# EAGLE design RTI-Dome (EAGLE 7.7.0)
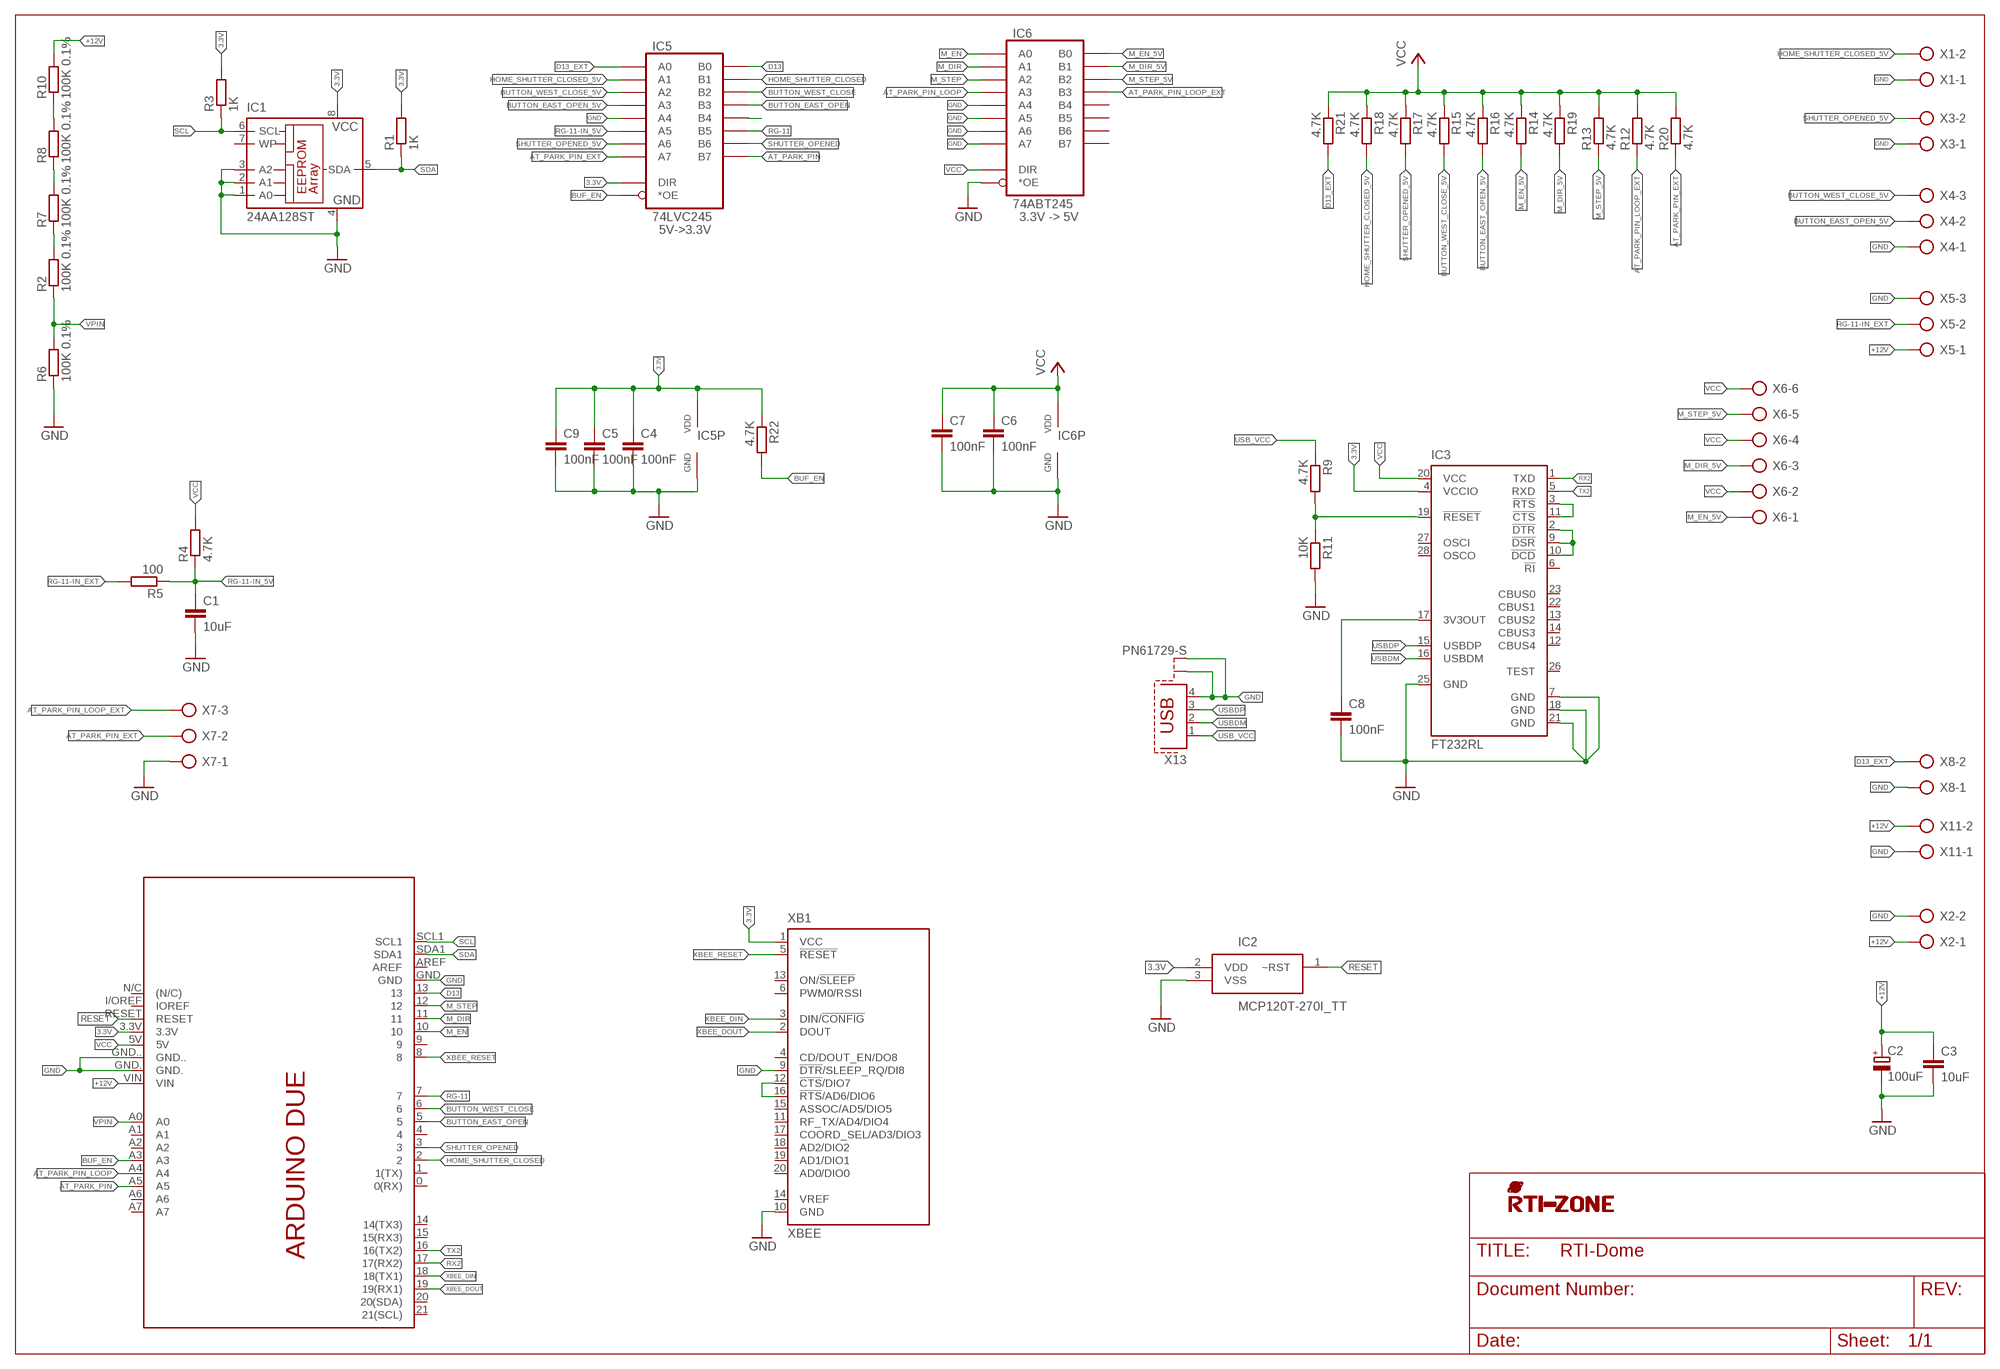
[diagram p0: schematic, sheet 1]

## Parts
C1  10uF  C-EU'0805'  [C0805]
C2  100uF  CPOL-EU  [UD-10X10_NICHICON]
C3  10uF  C-EU'0805'  [C0805]
C4  100nF  C-EU'0805'  [C0805]
C5  100nF  C-EU'0805'  [C0805]
C6  100nF  C-EU'0805'  [C0805]
C7  100nF  C-EU'0805'  [C0805]
C8  100nF  C-EU'0805'  [C0805]
C9  100nF  C-EU'0805'  [C0805]
IC1  24AA128ST  [TSSOP8]
IC2  MCP120T-270I_TT  [SOT95P237X112-3N]
IC3  FT232RL  [SSOP28]
IC5  74LVC245  [TSSOP20]
IC6  74ABT245  [TSSOP20]
PCB1  ARDUINO_DUE_SHIELD_SHORT  [ARDUINO_DUE_SHIELD_SHORT]
R1  1K  R-EU'0805'  [R0805]
R2  100K 0.1%  R-EU'0805'  [R0805]
R3  1K  R-EU'0805'  [R0805]
R4  4.7K  R-EU'0805'  [R0805]
R5  100  R-EU'0805'  [R0805]
R6  100K 0.1%  R-EU'0805'  [R0805]
R7  100K 0.1%  R-EU'0805'  [R0805]
R8  100K 0.1%  R-EU'0805'  [R0805]
R9  4.7K  R-EU'0805'  [R0805]
R10  100K 0.1%  R-EU'0805'  [R0805]
R11  10K  R-EU'0805'  [R0805]
R12  4.7K  R-EU'0805'  [R0805]
R13  4.7K  R-EU'0805'  [R0805]
R14  4.7K  R-EU'0805'  [R0805]
R15  4.7K  R-EU'0805'  [R0805]
R16  4.7K  R-EU'0805'  [R0805]
R17  4.7K  R-EU'0805'  [R0805]
R18  4.7K  R-EU'0805'  [R0805]
R19  4.7K  R-EU'0805'  [R0805]
R20  4.7K  R-EU'0805'  [R0805]
R21  4.7K  R-EU'0805'  [R0805]
R22  4.7K  R-EU'0805'  [R0805]
U$4  RTI-LOGO_BIG  [LOGO_BIG]
X1  AK500/2  [AK500/2]
X2  AK500/2  [AK500/2]
X3  AK500/2  [AK500/2]
X4  AK500/3  [AK500/3]
X5  AK500/3  [AK500/3]
X6  AK500/6  [AK500/6]
X7  AK500/3  [AK500/3]
X8  AK500/2  [AK500/2]
X11  AK500/2  [AK500/2]
X13  PN61729-S  [PN61729-S]
XB1  XBEE  [XBEE]

## Nets
3.3V: C4.1 C5.1 C9.1 IC1.8(VCC) IC2.2(VDD) IC3.4(VCCIO) IC5.P$1(DIR) IC5.P$20(VDD) PCB1.3.3V R1.2 R3.2 R22.1 XB1.1(VCC)
+12V [+12V]: C2.+ C3.1 PCB1.VIN R10.2 X2.1 X5.1 X11.2
AT_PARK_PIN: IC5.P$11(B7) PCB1.A5
AT_PARK_PIN_EXT: IC5.P$9(A7) R20.1 X7.2
AT_PARK_PIN_LOOP: IC6.P$5(A3) PCB1.A4
AT_PARK_PIN_LOOP_EXT: IC6.P$15(B3) R12.1 X7.3
BUF_EN: IC5.P$19(*OE) PCB1.A3 R22.2
BUTTON_EAST_OPEN: IC5.P$15(B3) PCB1.5
BUTTON_EAST_OPEN_5V: IC5.P$5(A3) R16.2 X4.2
BUTTON_WEST_CLOSE: IC5.P$16(B2) PCB1.6
BUTTON_WEST_CLOSE_5V: IC5.P$4(A2) R15.2 X4.3
D13: IC5.P$18(B0) PCB1.13
D13_EXT: IC5.P$2(A0) R21.2 X8.2
DTR_DSR_DCD: IC3.2(!DTR) IC3.9(!DSR) IC3.10(!DCD)
GND [GND]: C1.2 C2.- C3.2 C4.2 C5.2 C6.2 C7.2 C8.2 C9.2 IC1.1(A0) IC1.2(A1) IC1.3(A2) IC1.4(GND) IC2.3(VSS) IC3.7(GND) IC3.18(GND) IC3.21(GND) IC3.25(GND) IC5.P$6(A4) IC5.P$10(GND) IC6.P$6(A4) IC6.P$7(A5) IC6.P$8(A6) IC6.P$9(A7) IC6.P$10(GND) IC6.P$19(*OE) PCB1.GND PCB1.GND. PCB1.GND.. R6.1 R11.2 X1.1 X2.2 X3.1 X4.1 X5.3 X7.1 X8.1 X11.1 X13.4 X13.S1 X13.S2 XB1.9(!DTR!/SLEEP_RQ/DI8) XB1.10(GND)
HOME_SHUTTER_CLOSED: IC5.P$17(B1) PCB1.2
HOME_SHUTTER_CLOSED_5V: IC5.P$3(A1) R18.2 X1.2
M_DIR: IC6.P$3(A1) PCB1.11
M_DIR_5V: IC6.P$17(B1) R19.2 X6.3
M_EN: IC6.P$2(A0) PCB1.10
M_EN_5V: IC6.P$18(B0) R14.2 X6.1
M_STEP: IC6.P$4(A2) PCB1.12
M_STEP_5V: IC6.P$16(B2) R13.1 X6.5
N$1: IC3.19(!RESET) R9.2 R11.1
N$2: R7.2 R8.1
N$3: R8.2 R10.1
N$4: IC5.P$14(B4)
N$5: R2.2 R7.1
N$6: C8.1 IC3.17(3V3OUT)
N$9: XB1.12(!CTS!/DIO7) XB1.16(!RTS!/AD6/DIO6)
RESET: IC2.1(~RST) PCB1.RESET
RG-11: IC5.P$13(B5) PCB1.7
RG-11-IN_5V: C1.1 IC5.P$7(A5) R4.1 R5.1
RG-11-IN_EXT: R5.2 X5.2
RTS_CTS: IC3.3(!RTS) IC3.11(!CTS)
RX2: IC3.1(TXD) PCB1.17(17(RX2))
SCL: IC1.6(SCL) PCB1.SCL1 R3.1
SDA: IC1.5(SDA) PCB1.SDA1 R1.1
SHUTTER_OPENED: IC5.P$12(B6) PCB1.3
SHUTTER_OPENED_5V: IC5.P$8(A6) R17.2 X3.2
TX2: IC3.5(RXD) PCB1.16(16(TX2))
USB_VCC: R9.1 X13.1
USBDM: IC3.16(USBDM) X13.2
USBDP: IC3.15(USBDP) X13.3
VCC: C6.1 C7.1 IC3.20(VCC) IC6.P$1(DIR) IC6.P$20(VDD) PCB1.5V R4.2 R12.2 R13.2 R14.1 R15.1 R16.1 R17.1 R18.1 R19.1 R20.2 R21.1 X6.2 X6.4 X6.6
VPIN: PCB1.A0 R2.1 R6.2
XBEE_DIN: PCB1.18(18(TX1)) XB1.3(DIN/!CONFIG)
XBEE_DOUT: PCB1.19(19(RX1)) XB1.2(DOUT)
XBEE_RESET: PCB1.8 XB1.5(!RESET)
Unconnected: IC1.7(WP) IC3.6(!RI) IC3.12(CBUS4) IC3.13(CBUS2) IC3.14(CBUS3) IC3.22(CBUS1) IC3.23(CBUS0) IC3.26(TEST) IC3.27(OSCI) IC3.28(OSCO) IC6.P$11(B7) IC6.P$12(B6) IC6.P$13(B5) IC6.P$14(B4) PCB1.0(0(RX)) PCB1.1(1(TX)) PCB1.4 PCB1.9 PCB1.14(14(TX3)) PCB1.15(15(RX3)) PCB1.20(20(SDA)) PCB1.21(21(SCL)) PCB1.A1 PCB1.A2 PCB1.A6 PCB1.A7 PCB1.AREF PCB1.I/OREF(IOREF) PCB1.N/C((N/C)) XB1.4(CD/DOUT_EN/DO8) XB1.6(PWM0/RSSI) XB1.11(RF_TX/AD4/DIO4) XB1.13(ON/!SLEEP) XB1.14(VREF) XB1.15(ASSOC/AD5/DIO5) XB1.17(COORD_SEL/AD3/DIO3) XB1.18(AD2/DIO2) XB1.19(AD1/DIO1) XB1.20(AD0/DIO0)

## Notes on the sheet
- 3.3V -> 5V
- 5V->3.3V

## Library data of the parts
C1 C3-C9 = rti:C-EU
C2 = rti:CPOL-EU
IC1 = microchip:24*: Serial EEPROM I2C; MF: MICROCHIP; MPN: 24AA128-I/ST; OC_FARNELL: unknown; OC_NEWARK: 92C6843
IC2 = MCP120T-270I_TT:MCP120T-270I_TT: Microcontroller Supervisory Circuit Source: Datasheet; DESCRIPTION: Microcontroller Supervisory Circuit; HEIGHT: mm; MANUFACTURER_NAME: Microchip; MANUFACTURER_PART_NUMBER: MCP120T-270I/TT; MOUSER_PART_NUMBER: 579-MCP120T-270I/TT; MOUSER_PRICE-STOCK: https://www.mouser.co.uk/ProductDetail/Microchip-Technology/MCP120T-270I-TT?qs=JaP0%252BruNJH91Pwyk6aJdSA%3D%3D
IC3 = ftdichip:FT232R: Source: http://www.ftdichip.com/Documents/DataSheets/DS_FT232R_v104.pdf; MPN: FT232RL; OC_FARNELL: 1146032; OC_NEWARK: 91K9918
IC5 IC6 = rti:74*245
PCB1 = arduino_shield:ARDUINO_DUE_SHIELD_SHORT: Device for representing an Arduino Due board with a footprint in an EAGLE design. Created by Dave Young for Element14. More EAGLE documentation at: http://www.element14.com/community/community/knode/cadsoft_eagle
R1-R22 = rti:R-EU
U$4 = rti:RTI-LOGO
X1-X3 X8 X11 = con-ptr500:AK500/2: CONNECTOR; OC_FARNELL: unknown; OC_NEWARK: unknown
X4 X5 X7 = con-ptr500:AK500/3: CONNECTOR; OC_FARNELL: unknown; OC_NEWARK: unknown
X6 = con-ptr500:AK500/6: CONNECTOR; OC_FARNELL: unknown; OC_NEWARK: unknown
X13 = con-berg:PN61729-S: BERG USB connector; OC_FARNELL: unknown; OC_NEWARK: unknown
XB1 = maxstream:XBEE: XBee (TM) /XBee-PRO(TM) OEM RF Modules Source: MaxStream, Inc. xbee_productmanual.pdf; MPN: XBP24-Z7UIT-004; OC_FARNELL: 1751799; OC_NEWARK: 34R5507

## Net classes
0 default: width 0.254 mm, drill 0.3 mm, clearance 0.203 mm
1 +12V: width 0.254 mm, drill 0.3 mm, clearance 0.203 mm
2 GND: width 0.254 mm, drill 0.3 mm, clearance 0.203 mm

## Board
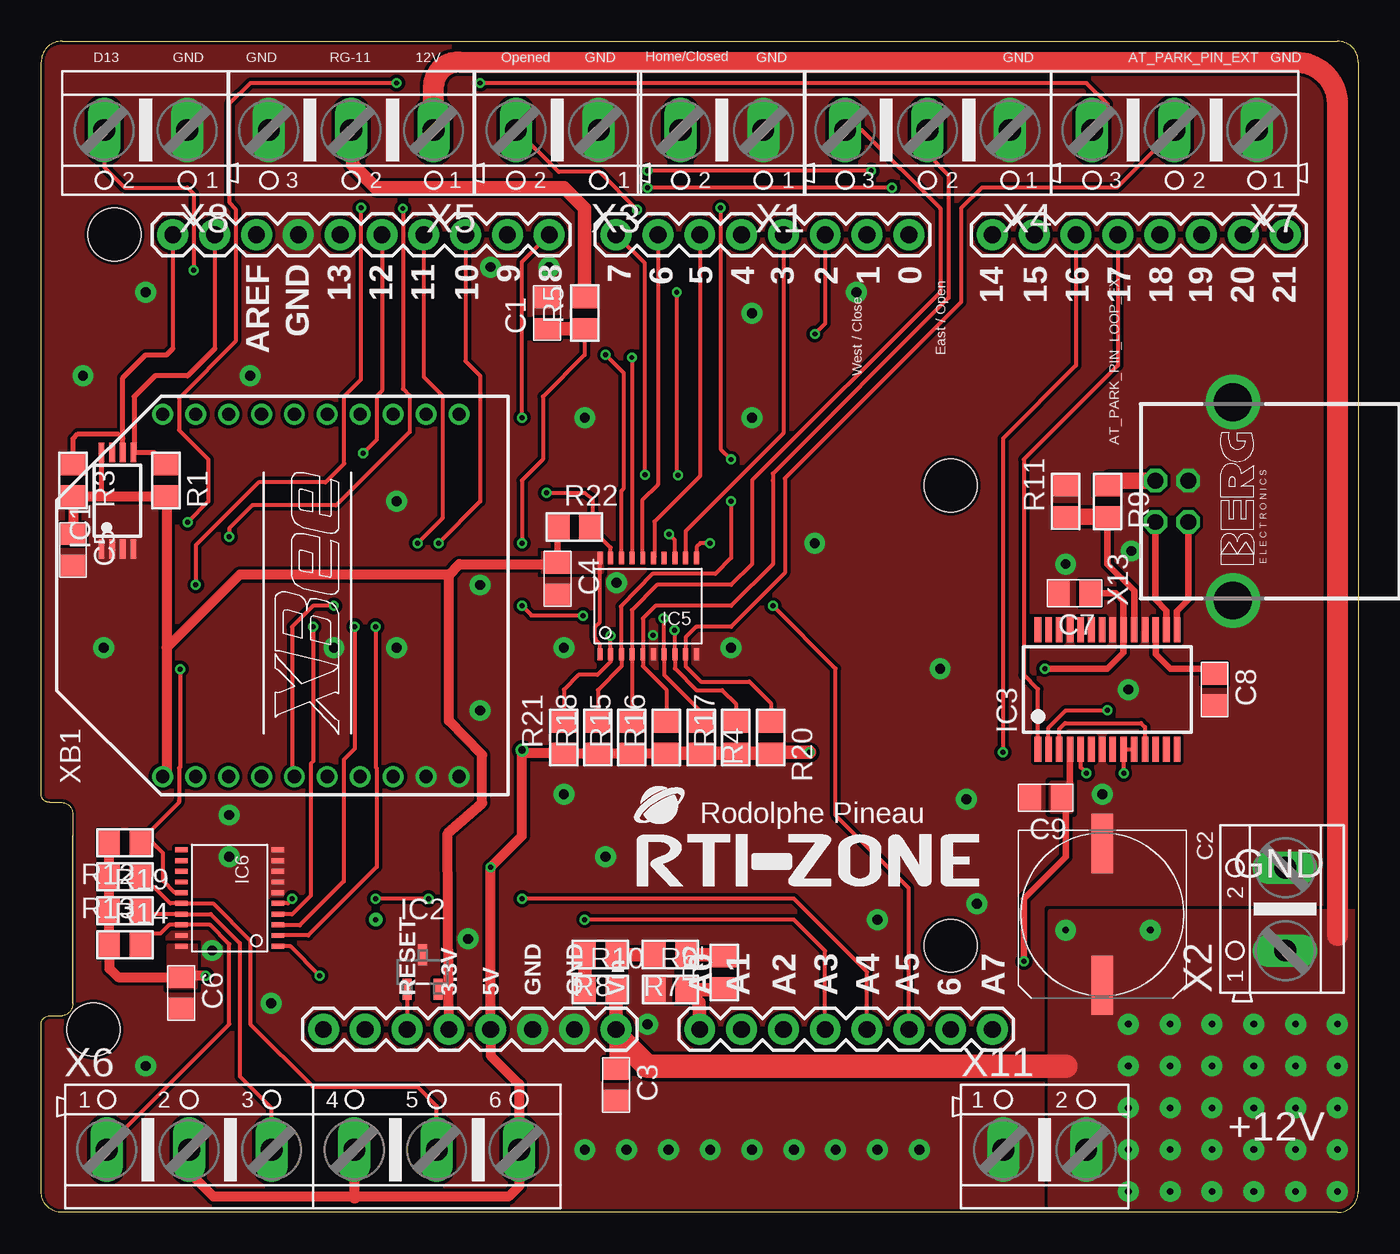
[diagram p1: board, top side]
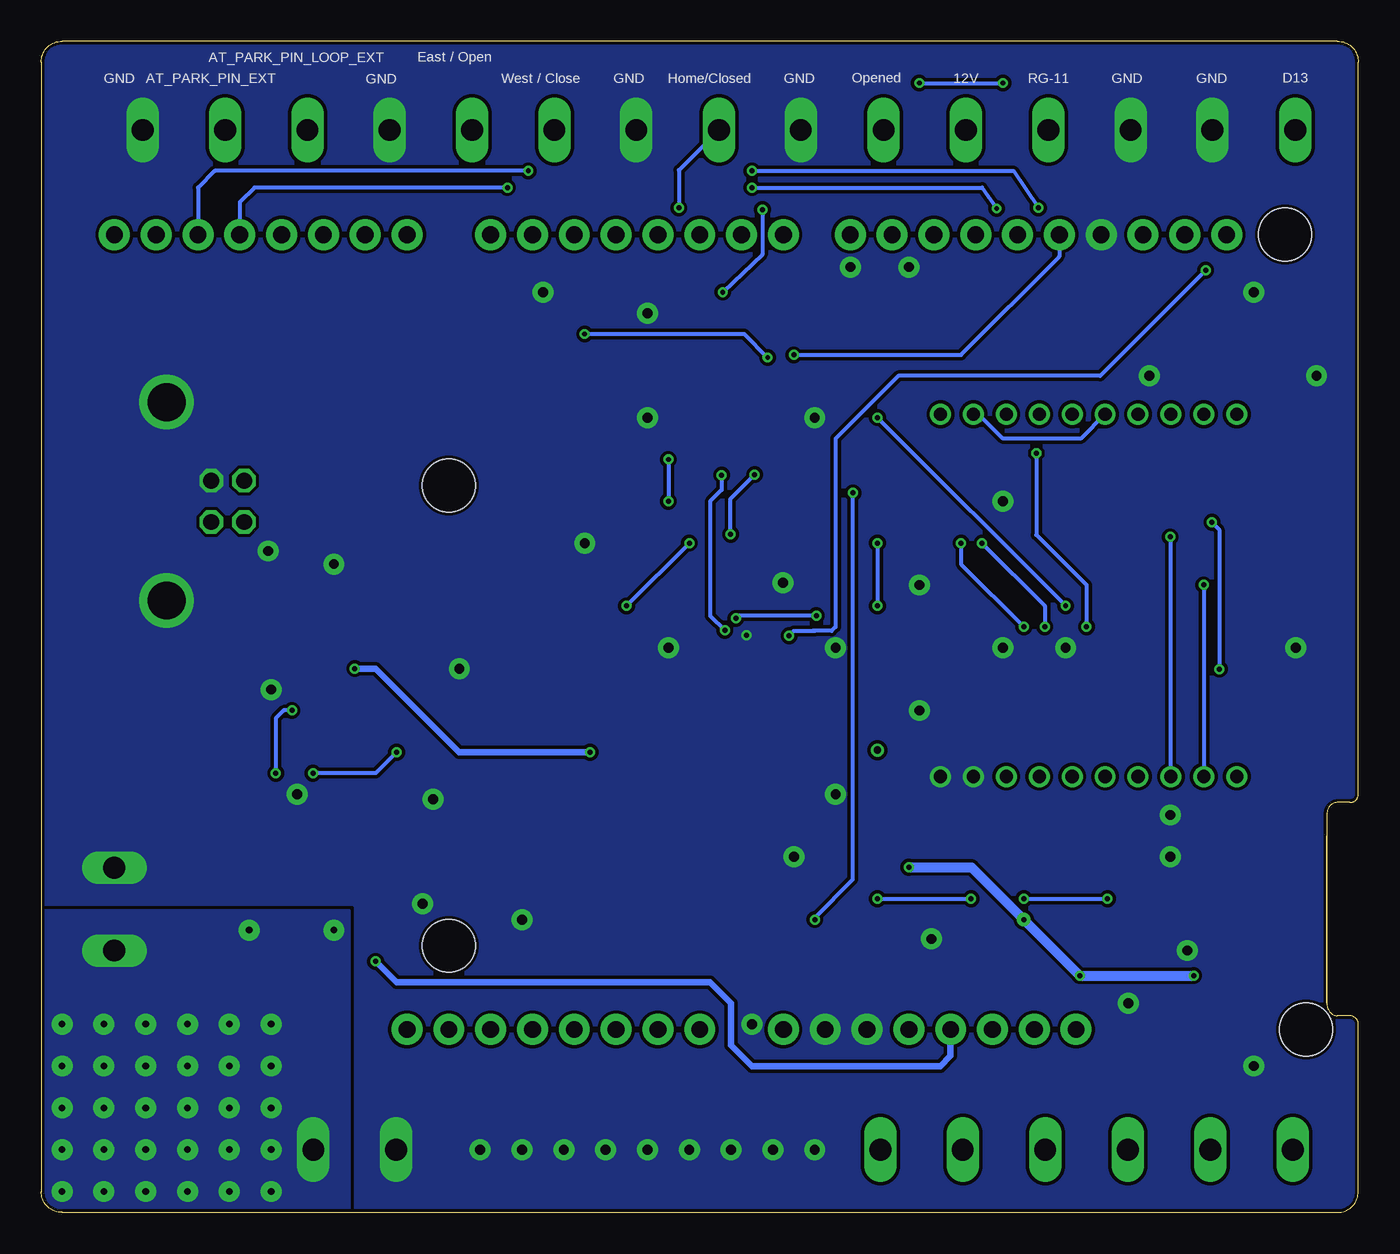
[diagram p2: board, bottom side, seen from below]

Size 80.01 x 71.12 mm. Coordinates in mm from the lower left corner, seen from the top.
Outline: 1.91,22.86 1.91,12.7
Outline: 1.91,12.7 1.91,22.86
Outline: 1.91,12.7 arc-90 1.27,11.94 0.51,11.94 arc90 0,11.43 0,1.27 arc90 1.27,0 78.74,0 arc90 80.01,1.27 80.01,69.85 arc90 78.74,71.12 1.27,71.12 arc90 0,69.85 0,25.4 arc90 0.51,24.89 1.27,24.89 arc-90 1.91,24.26 1.91,22.86
Copper layers (1*16): Top 0.35mm / dielectric 1.6mm / Bottom 0.35mm
Design rules "jlcpcb2layer": minimum track width 5mil, minimum drill 0.2mm, track to track 5mil, track to pad 5mil, pad to pad 5mil, via to via 5mil, smd to smd 5mil, copper to edge 8mil, drill to drill 0.5mm, minimum pad ring 6mil, minimum via ring 6mil, stop-mask expansion 0.05mm, vias tented up to drill 130mil, thermal gap 8mil

### Footprints (pad centres in the part's own frame; a part is rotated, then mirrored left to right if it is on the bottom)
C0805 = smd 1.3 x 1.5: 1 -0.95,0; 2 0.95,0
UD-10X10_NICHICON = smd 3.6 x 1.3: + 4.3,0; - -4.3,0
TSSOP8 = smd 0.35 x 1.2: 1 -0.975,-2.925; 2 -0.325,-2.925; 3 0.325,-2.925; 4 0.975,-2.925; 5 0.975,2.925; 6 0.325,2.925; 7 -0.325,2.925; 8 -0.975,2.925
SOT95P237X112-3N = smd 0.559 x 1.27: 1 -0.94,-1.041; 2 0.94,-1.041; 3 0,1.041
SSOP28 = smd 0.4 x 1.5: 1 -4.225,-3.625; 2 -3.575,-3.625; 3 -2.925,-3.625; 4 -2.275,-3.625; 5 -1.625,-3.625; 6 -0.975,-3.625; 7 -0.325,-3.625; 8 0.325,-3.625; 9 0.975,-3.625; 10 1.625,-3.625; 11 2.275,-3.625; 12 2.925,-3.625; 13 3.575,-3.625; 14 4.225,-3.625; 15 4.225,3.625; 16 3.575,3.625; 17 2.925,3.625; 18 2.275,3.625; 19 1.625,3.625; 20 0.975,3.625; 21 0.325,3.625; 22 -0.325,3.625; 23 -0.975,3.625; 24 -1.625,3.625; 25 -2.275,3.625; 26 -2.925,3.625; 27 -3.575,3.625; 28 -4.225,3.625
TSSOP20 = smd 0.75 x 0.3: P$1 -2.94,2.885; P$2 -2.94,2.235; P$3 -2.94,1.585; P$4 -2.94,0.935; P$5 -2.94,0.285; P$6 -2.94,-0.365; P$7 -2.94,-1.015; P$8 -2.94,-1.665; P$9 -2.94,-2.315; P$10 -2.94,-2.965; P$11 2.91,-2.965; P$12 2.91,-2.315; P$13 2.91,-1.665; P$14 2.91,-1.015; P$15 2.91,-0.365; P$16 2.91,0.285; P$17 2.91,0.935; P$18 2.91,1.585; P$19 2.91,2.235; P$20 2.91,2.885
ARDUINO_DUE_SHIELD_SHORT = drill 1.016 pad 1.88: 0 12.7,26.67; 1 10.16,26.67; 2 7.62,26.67; 3 5.08,26.67; 3.3V -15.24,-21.59; 4 2.54,26.67; 5 0,26.67; 5V -12.7,-21.59; 6 -2.54,26.67; 7 -5.08,26.67; 8 -9.144,26.67; 9 -11.684,26.67; 10 -14.224,26.67; 11 -16.764,26.67; 12 -19.304,26.67; 13 -21.844,26.67; 14 17.78,26.67; 15 20.32,26.67; 16 22.86,26.67; 17 25.4,26.67; 18 27.94,26.67; 19 30.48,26.67; 20 33.02,26.67; 21 35.56,26.67; A0 0,-21.59; A1 2.54,-21.59; A2 5.08,-21.59; A3 7.62,-21.59; A4 10.16,-21.59; A5 12.7,-21.59; A6 15.24,-21.59; A7 17.78,-21.59; AREF -26.924,26.67; GND -24.384,26.67; GND. -7.62,-21.59; GND.. -10.16,-21.59; I/OREF -20.32,-21.59; N/C -22.86,-21.59; RESET -17.78,-21.59; SCL1 -32.004,26.67; SDA1 -29.464,26.67; VIN -5.08,-21.59 | hole 3.2: -35.56,26.67; -36.83,-21.59; 15.24,11.43; 15.24,-16.51
R0805 = smd 1.3 x 1.5: 1 -0.95,0; 2 0.95,0
AK500/2 = drill 1.321 long: 1 -2.515,0; 2 2.515,0
AK500/3 = drill 1.321 long: 1 -5.004,0; 2 0,0; 3 5.004,0
AK500/6 = drill 1.321 long: 1 -12.522,0; 2 -7.518,0; 3 -2.515,0; 4 2.515,0; 5 7.518,0; 6 12.522,0
PN61729-S = drill 0.95 octagon: 1 1.25,4.71; 2 -1.25,4.71; 3 -1.25,2.71; 4 1.25,2.71 | drill 2.3 pad 2.9: S1 -6.02,0; S2 6.02,0
XBEE = drill 0.8 pad 1.27: 1 -11,9; 2 -11,7; 3 -11,5; 4 -11,3; 5 -11,1; 6 -11,-1; 7 -11,-3; 8 -11,-5; 9 -11,-7; 10 -11,-9; 11 11,-9; 12 11,-7; 13 11,-5; 14 11,-3; 15 11,-1; 16 11,1; 17 11,3; 18 11,5; 19 11,7; 20 11,9

### Placement (x,y rotation side)
C1  30.73,54.61 90 top
C2  64.45,18.1 270 top
C3  34.92,7.75 270 top
C4  31.37,38.48 270 top
C5  1.94,40.23 270 top
C6  8.51,13.34 270 top
C7  62.77,37.59 180 top
C8  71.28,31.75 270 top
C9  61.02,25.18 180 top
IC1  4.64,43.21 0 top
IC2  23.18,14.61 0 top
IC3  64.77,31.75 0 top
IC5  36.83,36.83 90 top
IC6  11.43,19.05 180 top
PCB1  40.01,32.7 0 top
R1  7.59,44.45 270 top
R2  41.5,14.57 90 top
R3  1.94,44.45 270 top
R4  40.1,28.83 270 top
R5  33.02,54.61 90 top
R6  38.23,13.53 0 top
R7  38.23,15.65 180 top
R8  33.97,15.65 180 top
R9  64.77,43.18 270 top
R10  33.97,13.53 0 top
R11  62.23,43.18 90 top
R12  5.08,22.45 180 top
R13  5.08,20.38 180 top
R14  5.08,16.26 0 top
R15  35.88,28.83 90 top
R16  37.97,28.83 90 top
R17  42.2,28.83 90 top
R18  33.81,28.83 90 top
R19  5.08,18.32 0 top
R20  44.32,28.83 270 top
R21  31.75,28.83 90 top
R22  32.38,41.62 0 top
U$4  36.2,19.81 0 top
X1  41.35,65.72 180 top
X2  75.56,18.41 90 top
X3  31.35,65.72 180 top
X4  53.84,65.72 180 top
X5  18.83,65.72 180 top
X6  16.51,3.81 0 top
X7  68.84,65.72 180 top
X8  6.35,65.72 180 top
X11  60.96,3.81 0 top
X13  72.39,43.18 90 top
XB1  16.38,37.47 90 top

### Tracks (layer width: path | path; a pad name or v marks a point on that pad's centre or on a via)
3.3V  (via drill 0.3)
  Top 0.254: IC5.P$1 33.94,34.51 33.69,34.77 33.69,34.86 33.66,34.89 33.66,35.56 33.95,35.85 IC5.P$20 | IC2.2 24.66,13.56 24.75,13.66
  Top 0.305: IC1.8 3.66,43.65 3.81,43.5
  Top 0.406: 31.43,39.49 C4.1 31.37,41.56 R22.1 | v59.69,15.24 59.69,16.51 59.69,19.05 62.23,21.59 62.23,24.92 C9.1 | IC3.4 62.49,25.66 62.23,25.4
  Top 0.61: 24.77,38.73 25.4,39.37 31.31,39.37 | 24.77,38.73 12.06,38.73 7.62,34.29 | 7.62,34.29 7.62,26.7 XB1.1 | PCB1.3.3V 24.75,13.66 24.7,23.02 26.8,24.86 26.8,27.78 24.77,29.84 24.77,38.73 | 7.62,34.29 7.62,43.47 arc90 R1.2 3.81,43.5 R3.2 C5.1
  Top 0.813: 31.31,39.37 C4.1
  Bottom 0.406: PCB1.3.3V 24.77,9.53 25.4,8.89 36.83,8.89 38.1,10.16 38.1,12.7 39.37,13.97 58.42,13.97 v59.69,15.24
  pour Top (isolate 0.254, no thermals): 30.48,40.07 34.07,40.07 34.07,38.86 30.48,38.86
  pour Top (no thermals): 61.4,26.04 62.55,26.04 62.55,24.38 61.4,24.38
+12V  (via drill 0.4 pad 1.27)
  Top 0.813: 34.95,11.14 PCB1.VIN | R10.2 PCB1.VIN | C3.1 PCB1.VIN
  Top 1.27: X5.1 23.83,68.38 arc-90 25.4,69.85 76.2,69.85 arc-90 78.74,67.31 78.74,16.83
  Top 1.422: PCB1.VIN 34.92,10.79 36.83,8.89 62.23,8.89
  other vias: 66.04,8.89 68.58,8.89 71.12,8.89 73.66,8.89 76.2,8.89 78.74,8.89 78.74,6.35 76.2,6.35 73.66,6.35 71.12,6.35 68.58,6.35 66.04,6.35 66.04,3.81 68.58,3.81 71.12,3.81 73.66,3.81 76.2,3.81 78.74,3.81 66.04,1.27 68.58,1.27 71.12,1.27 73.66,1.27 76.2,1.27 78.74,1.27 68.58,11.43 71.12,11.43 78.74,11.43 66.04,11.43 62.23,17.14 73.66,11.43 67.37,17.14 76.2,11.43
  pour Top (no thermals): 61.31,18.29 79.88,18.29 79.88,0 61.31,0
  pour Bottom (no thermals): 61.31,18.29 79.88,18.29 79.88,0 61.31,0
AT_PARK_PIN  (via drill 0.3 pad 0.25)
  Top 0.254: PCB1.A5 52.7,19.68 48.26,24.13 48.26,33.02 v44.45,36.83 | v40.64,40.64 40.04,40.64 39.81,40.42 39.81,39.76 IC5.P$11
  Bottom 0.254: v44.45,36.83 v40.64,40.64
AT_PARK_PIN_EXT
  Top 0.254: R20.1 44.32,30.92 43.02,32.23 40.07,32.23 39.15,33.15 IC5.P$9 39.15,34.92 39.78,35.56 41.91,35.56 45.18,38.83 45.18,44.58 55.88,55.28 55.88,60.96 57.15,62.23 65.35,62.23 X7.2
AT_PARK_PIN_LOOP  (via drill 0.3 pad 0.25)
  Top 0.254: PCB1.A4 50.16,14.61 45.72,19.05 v29.21,19.05 | v23.53,19.05 v20.32,19.05 | v15.24,19.05 15.24,19.02 14.99,18.76 IC6.P$5
  Bottom 0.254: v29.21,19.05 v23.53,19.05 | v20.32,19.05 v15.24,19.05
AT_PARK_PIN_LOOP_EXT  (via drill 0.3 pad 0.25)
  Top 0.254: IC6.P$15 8.11,19.41 7.4,20.13 7.4,21.81 6.99,22.23 6.35,22.86 8.38,24.89 8.38,25.02 8.38,26.99 8.45,27.05 v8.45,32.99 | 6.35,22.77 R12.1 | X7.3 64.78,67.3 63.5,68.58 v26.67,68.58 | v21.59,68.58 12.7,68.58 11.43,67.31 11.43,61.34 11.81,60.93 11.81,52.9 8.38,49.44 8.38,47.5 10.16,45.72 10.16,43.18 v8.89,41.91
  Top 0.305: 6.35,22.86 6.35,22.77
  Bottom 0.254: v26.67,68.58 v21.59,68.58 | v8.89,41.91 8.45,41.47 v8.45,32.99
BUF_EN  (via drill 0.3 pad 0.25)
  Top 0.254: IC5.P$19 34.59,40.36 R22.2 33.5,41.78 33.5,43.34 33.02,43.69 v30.7,43.69 | PCB1.A3 47.62,15.88 45.72,17.78 v33.02,17.78
  Bottom 0.254: v33.02,17.78 33.02,17.91 30.7,20.23 v30.7,43.69
BUTTON_EAST_OPEN
  Top 0.254: PCB1.5 40.01,44.7 37.24,41.94 37.24,39.79 IC5.P$15
BUTTON_EAST_OPEN_5V
  Top 0.254: R16.2 37.97,31.75 36.55,33.18 IC5.P$5 36.54,36.07 37.31,36.83 41.91,36.83 44.45,39.37 44.45,44.45 44.45,44.86 55.12,55.53 55.12,62.99 53.84,64.27 X4.2
BUTTON_WEST_CLOSE
  Top 0.254: PCB1.6 37.47,44.2 36.51,43.24 36.51,39.77 IC5.P$16
BUTTON_WEST_CLOSE_5V
  Top 0.254: R15.2 35.9,29.8 IC5.P$4 35.88,33.91 35.88,36.58 37.4,38.1 41.91,38.1 43.18,39.37 43.18,44.45 54.61,55.88 54.61,60.96 49.85,65.72 X4.3
D13  (via drill 0.3 pad 0.25)
  Top 0.254: IC5.P$18 35.24,43.82 35.4,43.97 35.4,50.96 v34.29,52.07
  Bottom 0.254: PCB1.13 18.16,58.04 24.13,52.07 v34.29,52.07
D13_EXT  (via drill 0.3 pad 0.25)
  Top 0.254: R21.2 31.75,31.75 32.64,32.64 33.78,32.64 34.59,33.45 IC5.P$2 34.58,33.91 v34.58,35.02 | v9.27,57.21 9.27,61.85 8.89,62.23 5.08,62.23 3.83,63.48 X8.2
  Bottom 0.254: v9.27,57.21 15.68,50.8 27.94,50.8 31.75,46.99 31.75,35.56 32,35.31 33.02,35.31 | 33.02,35.31 33.15,35.31 | v34.58,35.02 34.29,35.31 33.02,35.31
DTR_DSR_DCD  (via drill 0.3)
  Top 0.254: IC3.2 61.2,29.45 62.23,30.48 v64.77,30.48 | v65.75,26.67 65.75,28.12 | IC3.9 IC3.10
  Top 0.305: 65.75,28.12 IC3.9
  Bottom 0.254: v64.77,30.48 65.28,30.48 65.75,30 v65.75,26.67
GND  (via drill 0.3 pad 0.25, 0.6 pad 1.27)
  other vias: 41.91,34.29 26.67,38.1 43.18,48.26 31.75,25.4 26.67,30.48 33.02,48.26 30.86,57.4 27.3,57.4 21.59,43.18 17.78,34.29 66.23,40.16 12.7,50.8 56.2,25.08 11.43,21.59 62.23,39.37 50.8,17.78 34.29,21.59 54.61,33.02 64.45,25.4 56.83,18.73 43.18,54.61 34.96,38.23 46.99,40.64 49.53,55.88 21.59,34.29 3.81,34.29 31.75,34.29 66.04,31.75 11.43,24.13 13.97,12.7 25.94,16.61 6.35,8.89 10.38,15.91 33.02,3.81 2.54,50.8 6.35,55.88 36.83,11.43 37.18,35.05 35.56,3.81 38.1,3.81 40.64,3.81 43.18,3.81 45.72,3.81 48.26,3.81 50.8,3.81 53.34,3.81
  pour Bottom (rank 2, no thermals): 0,0 0,71.12 80.01,71.12 80.01,0
  pour Top (rank 2, no thermals): 0,0 0,71.12 80.01,71.12 80.01,0
HOME_SHUTTER_CLOSED  (via drill 0.3 pad 0.25)
  Top 0.254: PCB1.2 47.62,53.98 v46.99,53.34 | 35.88,39.76 IC5.P$17 35.88,39.76 | v35.88,51.91 35.88,39.76
  Bottom 0.254: v46.99,53.34 37.31,53.34 v35.88,51.91
HOME_SHUTTER_CLOSED_5V  (via drill 0.3 pad 0.25)
  Top 0.254: R18.2 33.81,31.72 35.24,33.15 IC5.P$3 35.21,33.92 35.21,36.8 37.15,38.77 40.96,38.77 41.91,39.75 v41.91,43.18 | v41.27,60.99 41.27,46.35 v41.91,45.72
  Bottom 0.254: v41.91,45.72 v41.91,43.18 | X1.2 41.27,63.28 v41.27,60.99
M_DIR  (via drill 0.3 pad 0.25)
  Top 0.254: PCB1.11 23.24,50.74 24.38,49.59 24.38,42.16 v22.86,40.64 | v19.05,35.56 19.05,28.16 18.38,27.5 18.38,20.1 15.72,17.43 14.4,17.43 IC6.P$3
  Bottom 0.254: v22.86,40.64 19.05,36.83 v19.05,35.56
M_DIR_5V
  Top 0.254: R19.2 6.24,18.11 IC6.P$17 10.3,18.11 12.06,16.35 12.06,8.26 13.99,6.33 X6.3
M_EN  (via drill 0.3 pad 0.25)
  Top 0.254: PCB1.10 25.78,51.69 26.67,50.8 26.67,43.18 v24.13,40.64 | v20.32,35.56 20.32,27.02 20.38,26.96 20.38,20.99 16.22,16.83 14.38,16.83 IC6.P$2
  Bottom 0.254: v24.13,40.64 24.13,39.37 v20.32,35.56
M_EN_5V
  Top 0.254: R14.2 6.7,16.92 7.24,16.92 7.78,17.46 IC6.P$18 10.26,17.46 11.43,16.29 11.43,11.43 3.99,3.99 X6.1
M_STEP  (via drill 0.3 pad 0.25)
  Top 0.254: PCB1.12 20.7,49.88 20.38,49.56 20.38,46.93 v19.56,46.1 | v16.51,35.56 16.51,27.37 16.38,27.24 16.38,19.24 15.24,18.1 14.39,18.1 IC6.P$4
  Bottom 0.254: v19.56,46.1 19.56,41.15 16.51,38.1 v16.51,35.56
M_STEP_5V
  Top 0.254: R13.1 6.67,19.75 6.86,19.75 7.84,18.77 IC6.P$16 10.45,18.77 12.7,16.51 12.7,11.43 16.51,7.62 22.86,7.62 24.03,6.45 X6.5
N$1
  Top 0.406: IC3.19 66.39,37.74 64.77,39.37 R9.2
  Top 1.016: R11.1 R9.2
N$2
  Top 0.813: R8.1 R7.2
N$3
  Top 0.813: R8.2 R10.1
N$5
  Top 0.813: R7.1 41.37,15.65 R2.2
N$6
  Top 0.406: IC3.17 67.69,33.91 68.58,33.02 70.99,33.02 C8.1
N$9
  Bottom 0.254: XB1.16 16.86,46.99 21.59,46.99 23.07,48.47 XB1.12
RESET
  Top 0.254: IC2.1 22.24,11.12 PCB1.RESET
RG-11  (via drill 0.3 pad 0.25)
  Top 0.254: v36.67,44.8 36.67,57.63 PCB1.7 | IC5.P$13 38.49,40.82 v38.13,41.18
  Bottom 0.254: v38.13,41.18 38.13,43.34 v36.67,44.8
RG-11-IN_5V  (via drill 0.3 pad 0.25)
  Top 0.254: R4.1 40.1,30.39 37.84,32.64 IC5.P$7 37.81,33.92 v37.81,36.07 | R5.1 33.02,52.07 30.48,49.53 30.48,45.72 29.21,44.45 v29.21,40.64 | v29.21,36.83 29.78,36.26 32.89,36.26 v32.92,36.23
  Top 0.813: C1.1 R5.1
  Bottom 0.254: v29.21,40.64 v29.21,36.83 | v32.92,36.23 37.66,36.23 v37.81,36.07
RG-11-IN_EXT
  Top 0.813: R5.2 33.02,60.96 31.75,62.23 20.32,62.23 18.92,63.63 X5.2
RTS_CTS
  Top 0.254: IC3.3 61.84,29.36 62.2,29.72 66.8,29.72 67.06,29.46 67.06,28.14 IC3.11
RX2
  Top 0.254: PCB1.17 65.41,51.44 59.69,45.72 59.69,32.64 60.55,31.78 IC3.1
  Top 0.406: IC3.1
SCL
  Top 0.254: PCB1.SCL1 8,52.45
  Top 0.305: IC1.6 4.96,46.99 | 4.96,46.99 4.96,50.68 6.35,52.07 7.62,52.07 8,52.45 | R3.1 1.94,46.99 2.22,47.28 4.67,47.28 4.96,46.99
SDA
  Top 0.254: PCB1.SDA1 10.54,52.45
  Top 0.305: 10.54,52.45 8.89,50.8 6.92,50.8 5.65,49.53 5.65,46.18 IC1.5 6.85,46.14 R1.1
SHUTTER_OPENED
  Top 0.254: PCB1.3 45.09,47.31 39.15,41.37 IC5.P$12
SHUTTER_OPENED_5V  (via drill 0.3 pad 0.25)
  Top 0.254: R17.2 42.2,30.89 41.37,31.72 39.81,31.72 38.49,33.04 IC5.P$8 38.48,33.9 v38.48,35.34 | v38.61,55.88 38.61,44.83 v38.67,44.77 | v36.2,60.9 33.91,63.18 31.43,63.18 28.89,65.72 X3.2
  Bottom 0.254: v36.2,60.9 36.2,58.17 v38.61,55.88 | v38.67,44.77 38.67,43.88 39.37,43.18 39.37,36.23 v38.48,35.34
TX2  (via drill 0.3)
  Top 0.254: PCB1.16 62.87,51.44 58.42,46.99 v58.42,27.94 | v63.5,26.67 63.15,27.02 IC3.5
  Top 0.406: 63.15,28.13 IC3.5
  Bottom 0.254: v58.42,27.94 59.69,26.67 v63.5,26.67
USB_VCC
  Top 1.016: X13.1 64.94,44.43 R9.1
USBDM
  Top 0.406: X13.2 67.68,37.22 68.36,36.54 68.36,35.39 IC3.16
USBDP
  Top 0.406: X13.3 69.68,37.2 68.99,36.51 IC3.15
VCC  (via drill 0.3, 0.3 pad 0.25, 0.3 pad 0.81, 0.45 pad 0.81)
  Top 0.254: v16.92,14.38 15.14,16.16 IC6.P$1
  Top 0.406: v60.96,33.02 64.77,33.02 65.75,33.99 IC3.20 65.75,37.12 65.28,37.59 C7.1
  Top 0.61: C6.1 | C6.1 4.67,14.29 4.16,14.79 4.16,16.22 R14.1 R19.1 R13.2 | v10,14.38 8.61,14.38 C6.1 | 8.89,3.71 8.89,2.54 10.48,0.95 19.05,0.95 28.38,0.95 29.03,1.6 X6.6 29.03,7.8 27.3,9.53 PCB1.5V v27.3,20.95 29.21,22.86 v29.21,28.07 29.4,27.88 R21.1 R18.1 R15.1 R16.1 | X6.4 19.02,0.98 | R13.2 3.87,20.38 3.81,20.32 | R13.2 R12.2
  Top 0.813: 8.89,3.71 X6.2 | 19.02,0.98 19.05,0.95 | C6.1 | R16.1 R4.2 R17.1 R20.2 44.38,27.94 v46.67,27.94
  Bottom 0.406: v60.96,33.02 59.69,33.02 54.61,27.94 v46.67,27.94
  Bottom 0.61: v27.3,20.95 23.5,20.95 v20.32,17.78 v16.92,14.38 v10,14.38
  pour Top (no thermals): 7.75,16.22 9.4,16.22 9.4,13.65 7.75,13.65
VPIN
  Top 0.813: PCB1.A0 39.97,12.73 R6.2 41.4,13.53 R2.1
XBEE_DIN  (via drill 0.3)
  Top 0.254: v51.69,62.23 v36.83,62.23 | v11.43,41.02 11.43,41.53 12.83,42.93 17.91,42.93 22.38,47.4 22.38,49.59 21.97,50.01 v21.97,60.96
  Bottom 0.254: v36.83,62.23 22.86,62.23 v21.97,60.96 | v11.43,41.02 11.43,26.51 | v51.69,62.23 67.06,62.23 67.94,61.34 PCB1.18
  Bottom 0.305: 11.43,26.51 XB1.3
XBEE_DOUT  (via drill 0.3)
  Top 0.254: v50.42,63.25 v36.83,63.25 | v9.4,38.1 9.4,40.51 13.21,44.32 17.27,44.32 18.41,45.47 18.41,49.56 19.43,50.58 v19.43,60.99
  Bottom 0.254: v36.83,63.25 20.95,63.25 v19.43,60.99 | v9.4,38.1 9.4,26.48 XB1.2 | v50.42,63.25 69.47,63.25 70.48,62.23 PCB1.19
XBEE_RESET  (via drill 0.3)
  Top 0.254: v17.78,36.83 16.51,36.83 15.24,35.56 15.24,26.61 XB1.5 | v29.21,48.26 29.21,57.72 PCB1.8
  Bottom 0.254: v29.21,48.26 v17.78,36.83

### Text on the board
tPlace: D13 | GND | GND | RG-11 | 12V | Opened | GND | Home/Closed | GND | GND | AT_PARK_PIN_EXT | GND | East / Open | West / Close | AT_PARK_PIN_LOOP_EXT | GND | +12V
bPlace: East / Open | AT_PARK_PIN_LOOP_EXT | D13 | GND | GND | RG-11 | 12V | Opened | GND | Home/Closed | GND | West / Close | GND | AT_PARK_PIN_EXT | GND